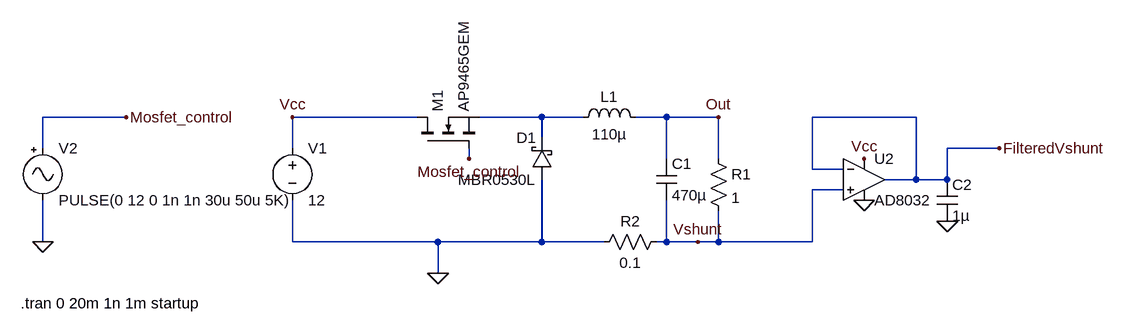
[diagram p0: schematic BuckConverter.asc]
BuckConverter.asc, the LTspice schematic file:
Version 4
SHEET 1 1020 680
WIRE -512 160 -640 160
WIRE -64 160 -256 160
WIRE 128 160 32 160
WIRE 192 160 128 160
WIRE 320 160 272 160
WIRE 400 160 320 160
WIRE 704 160 544 160
WIRE 128 192 128 160
WIRE -640 208 -640 160
WIRE -256 208 -256 160
WIRE 832 208 752 208
WIRE 16 224 16 208
WIRE 320 224 320 160
WIRE 400 224 400 160
WIRE 544 240 544 160
WIRE 592 240 544 240
WIRE 704 256 704 160
WIRE 704 256 656 256
WIRE 752 256 752 208
WIRE 752 256 704 256
WIRE 592 272 544 272
WIRE -640 352 -640 288
WIRE -256 352 -256 288
WIRE -32 352 -256 352
WIRE 128 352 128 256
WIRE 128 352 -32 352
WIRE 224 352 128 352
WIRE 320 352 320 288
WIRE 320 352 304 352
WIRE 368 352 320 352
WIRE 400 352 400 304
WIRE 400 352 368 352
WIRE 544 352 544 272
WIRE 544 352 400 352
WIRE -32 400 -32 352
FLAG -32 400 0
FLAG -640 352 0
FLAG -512 160 Mosfet_control
FLAG 16 224 Mosfet_control
FLAG 400 160 Out
FLAG 368 352 Vshunt
FLAG -256 160 Vcc
FLAG 624 224 Vcc
FLAG 624 288 0
FLAG 752 320 0
FLAG 832 208 FilteredVshunt
SYMBOL ind 176 176 R270
WINDOW 0 32 56 VTop 2
WINDOW 3 5 56 VBottom 2
SYMATTR InstName L1
SYMATTR Value 110µ
SYMATTR SpiceLine Ipk=7
SYMBOL schottky 144 256 R180
WINDOW 0 24 64 Left 2
WINDOW 3 24 0 Left 2
SYMATTR InstName D1
SYMATTR Value MBR0530L
SYMBOL res 384 208 R0
SYMATTR InstName R1
SYMATTR Value 1
SYMBOL res 320 336 R90
WINDOW 0 0 56 VBottom 2
WINDOW 3 32 56 VTop 2
SYMATTR InstName R2
SYMATTR Value 0.1
SYMBOL voltage -256 192 R0
WINDOW 123 0 0 Left 0
WINDOW 39 24 124 Left 2
SYMATTR InstName V1
SYMATTR Value 12
SYMBOL Misc\\signal -640 192 R0
WINDOW 123 0 0 Left 0
WINDOW 39 0 0 Left 0
SYMATTR InstName V2
SYMATTR Value PULSE(0 12 0 1n 1n 30u 50u 5K)
SYMBOL cap 304 224 R0
SYMATTR InstName C1
SYMATTR Value 470µ
SYMBOL nmos -64 208 R270
SYMATTR InstName M1
SYMATTR Value AP9465GEM
SYMBOL cap 736 256 R0
SYMATTR InstName C2
SYMATTR Value 1µ
SYMBOL Opamps\\AD8032 624 192 R0
SYMATTR InstName U2
TEXT -674 446 Left 2 !.tran 0 20m 1n 1m startup

The netlist it stands for:
* BuckConverter.asc
L1 N001 Out 110µ Ipk=7
D1 0 N001 MBR0530L
R1 Out Vshunt 1
R2 Vshunt 0 0.1
V1 Vcc 0 12
V2 Mosfet_control 0 PULSE(0 12 0 1n 1n 30u 50u 5K)
C1 Out Vshunt 470µ
M1 Vcc Mosfet_control N001 N001 AP9465GEM
C2 FilteredVshunt 0 1µ
XU2 Vshunt FilteredVshunt Vcc 0 FilteredVshunt AD8032  ; pins In+ In- V+ V- OUT
.model D D
.lib standard.dio
.model NMOS NMOS
.model PMOS PMOS
.lib standard.mos
.tran 0 20m 1n 1m startup
.backanno
.end